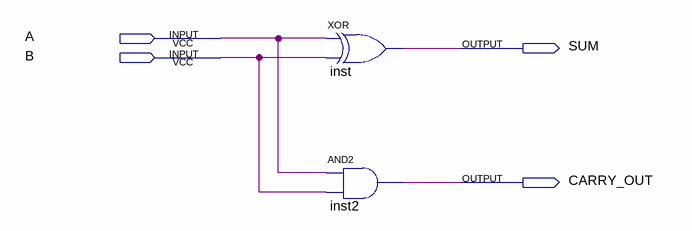
[diagram p0: schematic sheet]
// Quartus schematic halfAdder.bdf as structural Verilog: 2 symbols, 4 pins
module halfAdder (
  input  A,
  input  B,
  output SUM,
  output CARRY_OUT
);

  xor inst (SUM, A, B);
  and inst2 (CARRY_OUT, A, B);
endmodule
